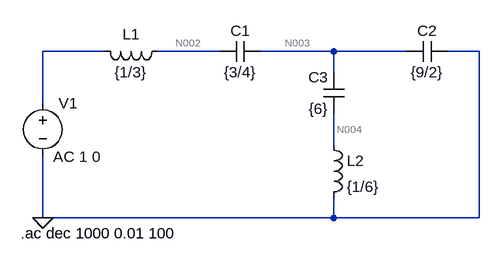
[diagram p0: schematic ej1.asc]
ej1.asc, the LTspice schematic file:
Version 4
SHEET 1 880 680
WIRE 160 48 64 48
WIRE 336 48 240 48
WIRE 512 48 400 48
WIRE 624 48 512 48
WIRE 736 48 688 48
WIRE 512 80 512 48
WIRE 64 128 64 48
WIRE 512 192 512 144
WIRE 64 304 64 208
WIRE 512 304 512 272
WIRE 512 304 64 304
WIRE 736 304 736 48
WIRE 736 304 512 304
FLAG 64 304 0
SYMBOL voltage 64 112 R0
WINDOW 3 16 126 Left 2
WINDOW 123 16 98 Left 2
WINDOW 39 0 0 Left 0
SYMATTR InstName V1
SYMATTR Value ""
SYMATTR Value2 AC 1 0
SYMBOL ind 256 32 R90
WINDOW 0 5 56 VBottom 2
WINDOW 3 32 56 VTop 2
SYMATTR InstName L1
SYMATTR Value {1/3}
SYMBOL cap 400 32 R90
WINDOW 0 0 32 VBottom 2
WINDOW 3 32 32 VTop 2
SYMATTR InstName C1
SYMATTR Value {3/4}
SYMBOL cap 688 32 R90
WINDOW 0 0 32 VBottom 2
WINDOW 3 32 32 VTop 2
SYMATTR InstName C2
SYMATTR Value {9/2}
SYMBOL cap 528 144 R180
WINDOW 0 24 56 Left 2
WINDOW 3 24 8 Left 2
SYMATTR InstName C3
SYMATTR Value {6}
SYMBOL ind 496 176 R0
SYMATTR InstName L2
SYMATTR Value {1/6}
TEXT 30 328 Left 2 !.ac dec 1000 0.01 100

The netlist it stands for:
* ej1.asc
V1 N001 0 AC 1 0
L1 N002 N001 {1/3}
C1 N003 N002 {3/4}
C2 0 N003 {9/2}
C3 N004 N003 {6}
L2 N004 0 {1/6}
.ac dec 1000 0.01 100
.backanno
.end

* Results of the author's LTspice run, read from the files saved beside the schematic
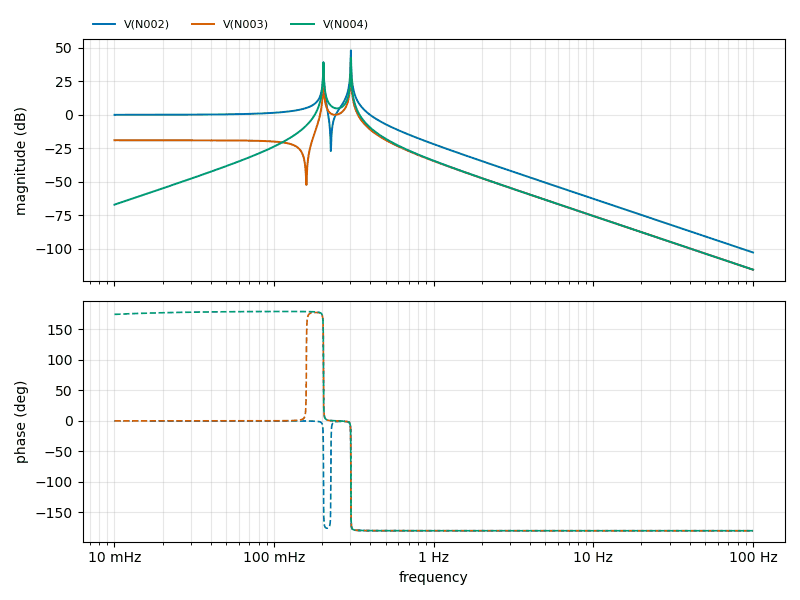
[diagram p1: AC Analysis of ej1.asc, plotted from the saved traces]
* AC Analysis, 1 run:
*   V(N002): 0.01 dB at 10 mHz, -102.63 dB at 100 Hz, peak 48.01 dB at 302.7 mHz, 3 dB below the peak at 302.1 mHz and 303 mHz
*   V(N003): -18.97 dB at 10 mHz, -115.45 dB at 100 Hz, peak 39.53 dB at 302.7 mHz, 3 dB below the peak at 302.1 mHz and 303 mHz
*   V(N004): -66.97 dB at 10 mHz, -115.45 dB at 100 Hz, peak 42.34 dB at 302.7 mHz, 3 dB below the peak at 302.1 mHz and 303 mHz